# Altium schematic sheet 09-蜂鸣器模块-原理图.SchDoc
size A4
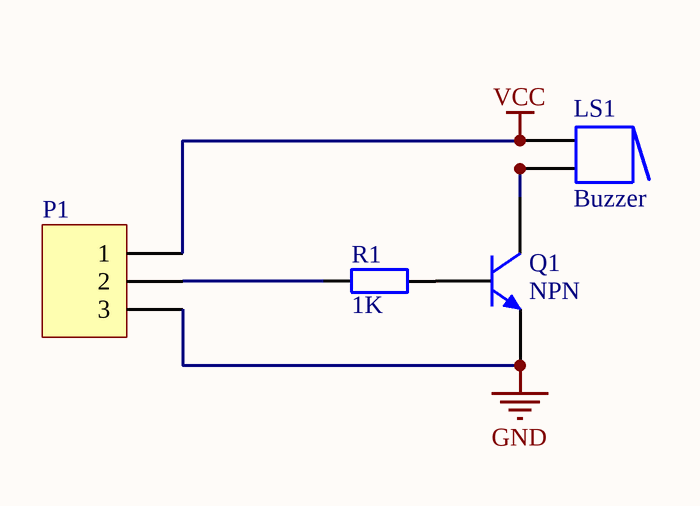
[diagram p0: 09-蜂鸣器模块-原理图.SchDoc]

## Parts
LS1  Buzzer  [ABSM-1574]
P1  Header 3  [HDR1X3]  (value not drawn)
Q1  NPN  [sot-23]
R1  value 1K  [r0603]  (hidden comment: Res2)

## Nets
GND: P1.3 Q1.2(E)
VCC: LS1.1 LS1.1A P1.1
NetLS1_2: LS1.2 LS1.2A Q1.3(C)
NetP1_2: P1.2 R1.1
NetQ1_1: Q1.1(B) R1.2

## Library data of the parts
LS1 = Buzzer: Magnetic Transducer Buzzer; Published: 24-Mar-1999; LatestRevisionDate: 17-Dec-2003; LatestRevisionNote: Schematic revised, PCB Footprint replaced.; DatasheetVersion: 17-Dec-2003; PackageReference: ABSM-1574; Publisher: Altium Limited; ComponentLink1Description: Manufacturer Link; ComponentLink1URL: http://www.megastar.com/linecard/buzzmode/index.php
P1 = Header 3: Header, 3-Pin; LatestRevisionDate: 17-Jul-2002; LatestRevisionNote: Re-released for DXP Platform.; Publisher: Altium Limited
Q1 = 2N3904: NPN General Purpose Amplifier; Published: 8-Jun-2000; LatestRevisionDate: 15-Jan-2003; LatestRevisionNote: PCB Footprint 'BCY-W3/D4.7' replaced; DatasheetVersion: 1997; PackageVersion: Sep-1998; PackageReference: TO-92A; Publisher: Altium Limited; Code_JEDEC: TO-92A; ComponentLink1Description: Manufacturer Link; ComponentLink1URL: http://www.fairchildsemi.com/; ComponentLink2Description: Datasheet; ComponentLink2URL: http://www.fairchildsemi.com/ds/2N%2F2N3904.pdf
R1 = Res2: Resistor; Published: 8-Jun-2000; LatestRevisionDate: 17-Jul-2002; LatestRevisionNote: Re-released for DXP Platform.; PackageReference: AXIAL-0.4; Publisher: Altium Limited